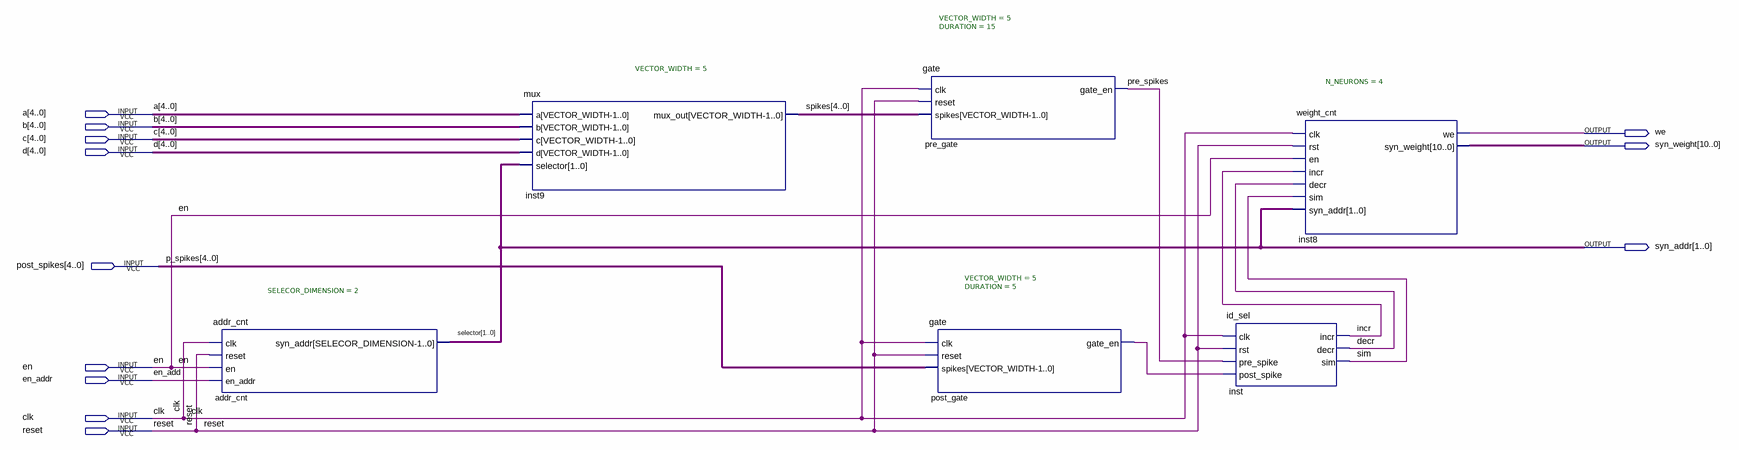
[diagram p0: schematic sheet]
// Quartus schematic STDP.bdf as structural Verilog: 6 symbols, 12 pins
module STDP (
  input  [4:0] a,
  input  [4:0] b,
  input  [4:0] c,
  input  [4:0] d,
  input  [4:0] post_spikes,
  input  en,
  input  en_addr,
  input  clk,
  input  reset,
  output we,
  output [10:0] syn_weight,
  output [1:0] syn_addr
);

  wire decr, incr, post_gate_gate_en, pre_spikes, sim;
  wire [4:0] spikes;

  addr_cnt #(.SELECOR_DIMENSION(2)) addr_cnt (
    .clk(clk), .reset(reset), .en(en), .en_addr(en_addr), .syn_addr(syn_addr));
  mux #(.VECTOR_WIDTH(5)) inst9 (.a(a), .b(b), .c(c), .d(d), .selector(syn_addr), .mux_out(spikes));
  gate #(.VECTOR_WIDTH(5), .DURATION(15)) pre_gate (.clk(clk), .reset(reset), .spikes(spikes), .gate_en(pre_spikes));
  gate #(.VECTOR_WIDTH(5), .DURATION(5)) post_gate (
    .clk(clk), .reset(reset), .spikes(post_spikes), .gate_en(post_gate_gate_en));
  id_sel inst (
    .clk(clk), .rst(reset), .pre_spike(pre_spikes), .post_spike(post_gate_gate_en), .incr(incr), .decr(decr),
    .sim(sim));
  weight_cnt #(.N_NEURONS(4)) inst8 (
    .clk(clk), .rst(reset), .en(en), .incr(incr), .decr(decr), .sim(sim), .syn_addr(syn_addr), .we(we),
    .syn_weight(syn_weight));

  // Other names for the same wires on the sheet: en_add = en_addr; p_spikes[4:0] = post_spikes;
  //   selector[1:0] = syn_addr
endmodule
